# Altium schematic sheet 1-PF0100_PMIC.SchDoc
size B
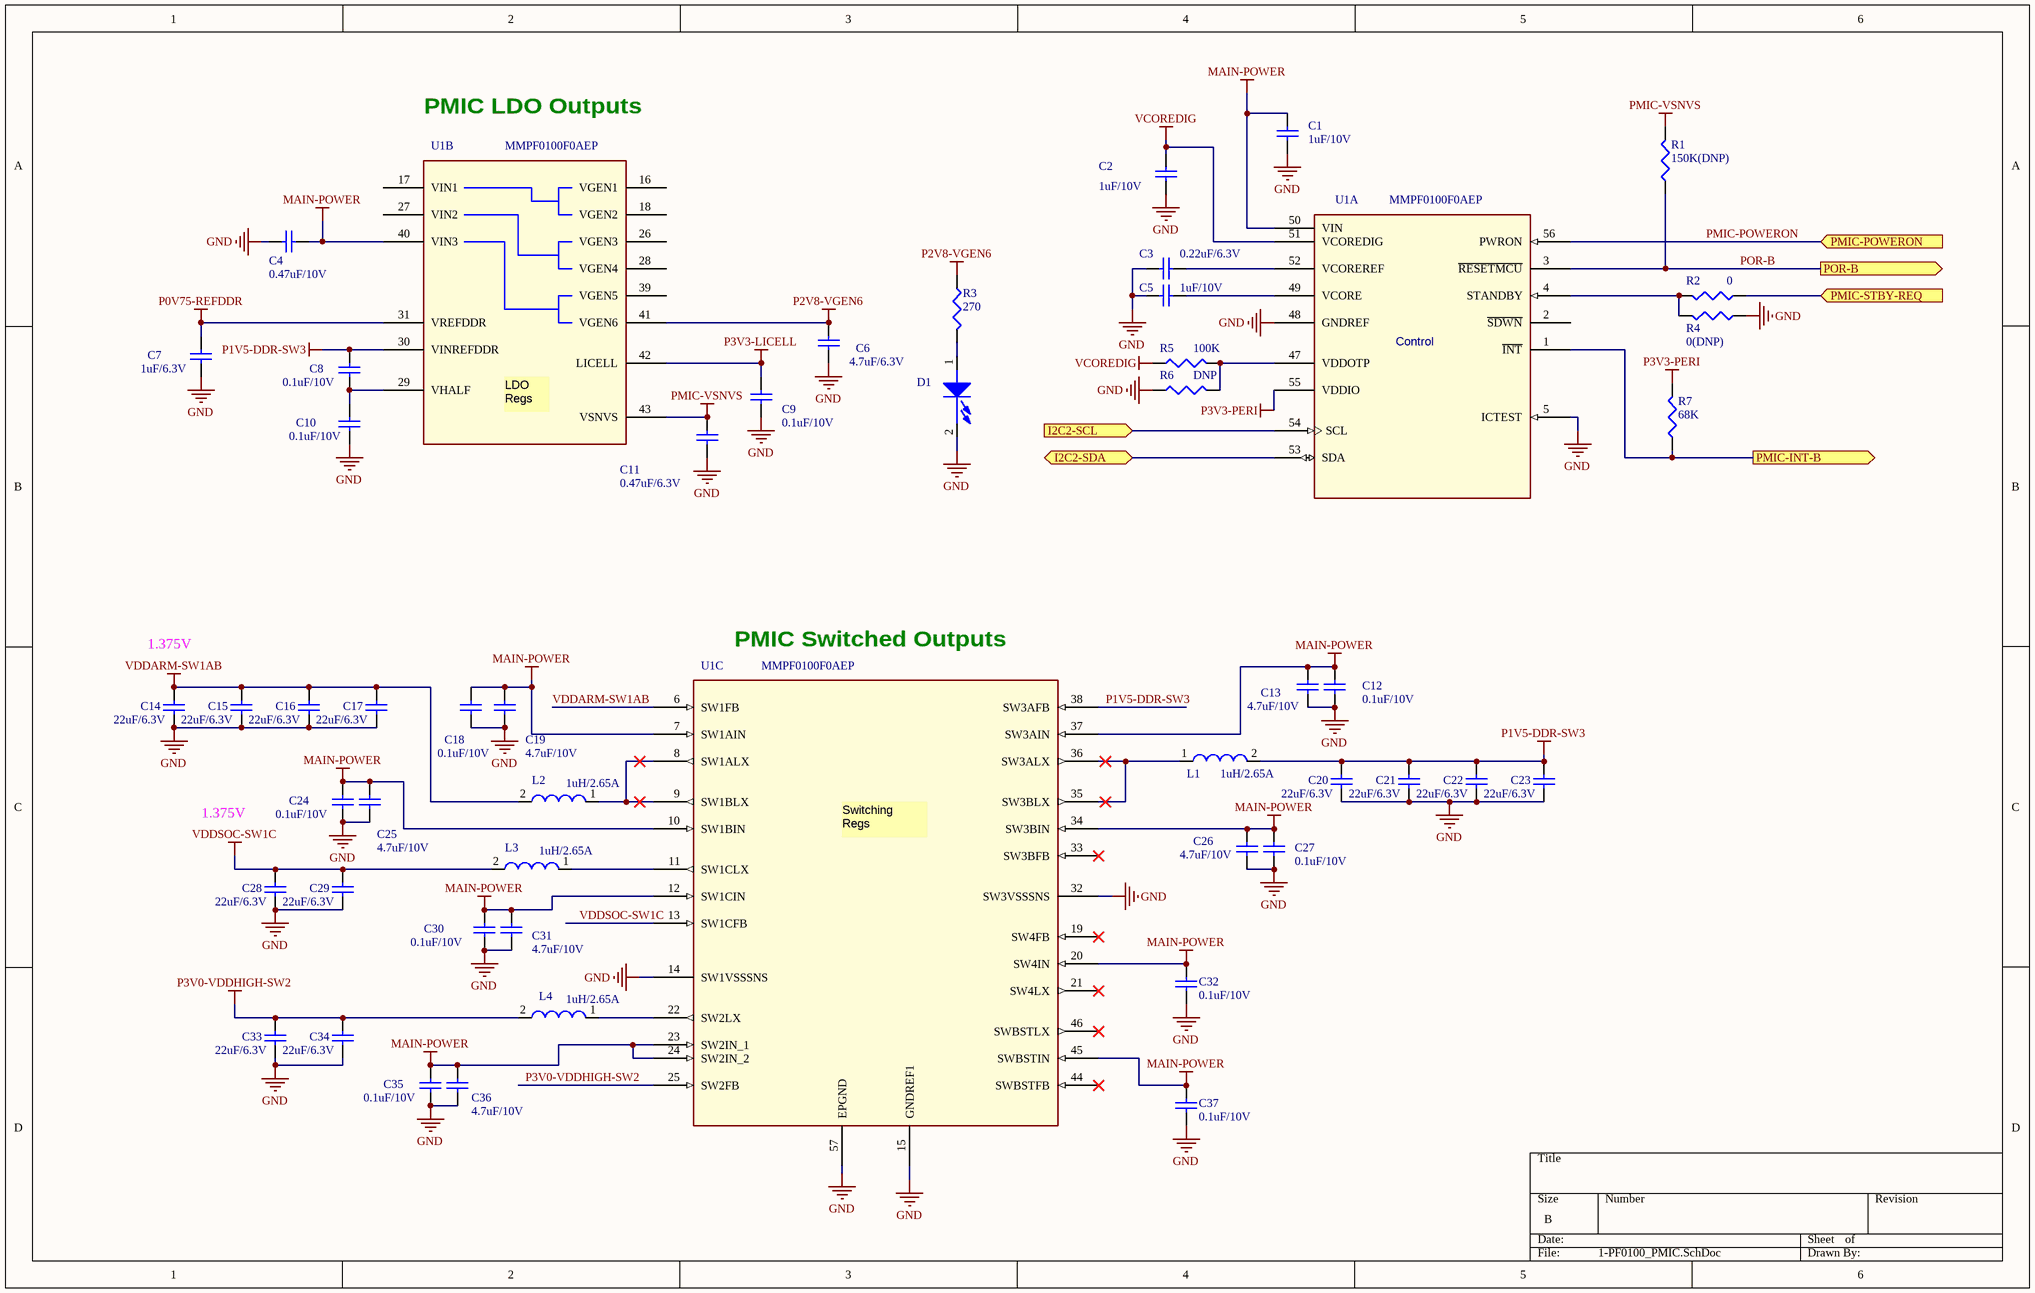
[diagram p0: 1-PF0100_PMIC.SchDoc]

## Parts
C1  1uF/10V  [0603_CC]
C2  1uF/10V  [0603_CC]
C3  0.22uF/6.3V  [0402_CC]
C4  0.47uF/10V  [0603_CC]
C5  1uF/10V  [0603_CC]
C6  4.7uF/6.3V  [0603_CC]
C7  1uF/6.3V  [0603_CC]
C8  0.1uF/10V  [0402_CC]
C9  0.1uF/10V  [0402_CC]
C10  0.1uF/10V  [0402_CC]
C11  0.47uF/6.3V  [0402_CC]
C12  0.1uF/10V  [0402_CC]
C13  4.7uF/10V  [0805_CC]
C14  22uF/6.3V  [0805_CC]
C15  22uF/6.3V  [0805_CC]
C16  22uF/6.3V  [0805_CC]
C17  22uF/6.3V  [0805_CC]
C18  0.1uF/10V  [0402_CC]
C19  4.7uF/10V  [0805_CC]
C20  22uF/6.3V  [0805_CC]
C21  22uF/6.3V  [0805_CC]
C22  22uF/6.3V  [0805_CC]
C23  22uF/6.3V  [0805_CC]
C24  0.1uF/10V  [0402_CC]
C25  4.7uF/10V  [0805_CC]
C26  4.7uF/10V  [0805_CC]
C27  0.1uF/10V  [0402_CC]
C28  22uF/6.3V  [0805_CC]
C29  22uF/6.3V  [0805_CC]
C30  0.1uF/10V  [0402_CC]
C31  4.7uF/10V  [0805_CC]
C32  0.1uF/10V  [0402_CC]
C33  22uF/6.3V  [0805_CC]
C34  22uF/6.3V  [0805_CC]
C35  0.1uF/10V  [0402_CC]
C36  4.7uF/10V  [0805_CC]
C37  0.1uF/10V  [0402_CC]
D1  LED GREEN  [LED0603]  (value not drawn)
L1  1uH/2.65A  [IND-1uH-2.65A]
L2  1uH/2.65A  [IND-1uH-2.65A]
L3  1uH/2.65A  [IND-1uH-2.65A]
L4  1uH/2.65A  [IND-1uH-2.65A]
R1  150K(DNP)  [0402_CC]
R2  0  [0402_CC]
R3  270  [0402_CC]
R4  0(DNP)  [0402_CC]
R5  100K  [0402_CC]
R6  DNP  [0402_CC]
R7  68K  [0402_CC]
U1  MMPF0100F0ZES  [QFN-56]  (value not drawn)  (parts A,B,C of 3)

## Ports
I2C2-SCL (in), I2C2-SDA (bidir), PMIC-INT-B (out), PMIC-POWERON (in), PMIC-STBY-REQ (in), POR-B (out)

## Nets
GND: C1.2 C2.2 C3.2 C4.2 C5.2 C6.2 C7.2 C9.2 C10.2 C11.2 C12.2 C13.2 C14.2 C15.2 C16.2 C17.2 C18.2 C19.2 C20.2 C21.2 C22.2 C23.2 C24.2 C25.2 C26.2 C27.2 C28.2 C29.2 C30.2 C31.2 C32.2 C33.2 C34.2 C35.2 C36.2 C37.1 D1.2(CATHODE) R4.1 R6.1 U1.5(ICTEST) U1.14(SW1VSSSNS) U1.15(GNDREF1) U1.32(SW3VSSSNS) U1.48(GNDREF) U1.57(EPGND)
MAIN-POWER: C1.1 C4.1 C12.1 C13.1 C18.1 C19.1 C24.1 C25.1 C26.1 C27.1 C30.1 C31.1 C32.1 C35.1 C36.1 C37.2 U1.7(SW1AIN) U1.10(SW1BIN) U1.12(SW1CIN) U1.20(SW4IN) U1.23(SW2IN_1) U1.24(SW2IN_2) U1.34(SW3BIN) U1.37(SW3AIN) U1.40(VIN3) U1.45(SWBSTIN) U1.50(VIN)
P0V75-REFDDR: C7.1 U1.31(VREFDDR)
P1V5-DDR-SW3: C8.1 C20.1 C21.1 C22.1 C23.1 L1.2 U1.30(VINREFDDR) U1.38(SW3AFB)
P2V8-VGEN6: C6.1 R3.1 U1.41(VGEN6)
P3V0-VDDHIGH-SW2: C33.1 C34.1 L4.2 U1.25(SW2FB)
P3V3-LICELL: C9.1 U1.42(LICELL)
P3V3-PERI: R7.2 U1.55(VDDIO)
PMIC-VSNVS: C11.1 R1.2 U1.43(VSNVS)
VCOREDIG: C2.1 R5.1 U1.51(VCOREDIG)
VDDARM-SW1AB: C14.1 C15.1 C16.1 C17.1 L2.2 U1.6(SW1FB)
VDDSOC-SW1C: C28.1 C29.1 L3.2 U1.13(SW1CFB)
I2C2-SCL: U1.54(SCL) ; port I2C2-SCL
I2C2-SDA: U1.53(SDA) ; port I2C2-SDA
PMIC-INT-B: R7.1 U1.1(~{INT}) ; port PMIC-INT-B
PMIC-POWERON: U1.56(PWRON) ; port PMIC-POWERON
PMIC-STBY-REQ: R2.1 ; port PMIC-STBY-REQ
POR-B: R1.1 U1.3(~{RESETMCU}) ; port POR-B
NetC3_1: C3.1 U1.52(VCOREREF)
NetC5_1: C5.1 U1.49(VCORE)
NetC8_2: C8.2 C10.1 U1.29(VHALF)
NetD1_1: D1.1(ANODE) R3.2
NetL1_1: L1.1 U1.35(SW3BLX) U1.36(SW3ALX)
NetL2_1: L2.1 U1.8(SW1ALX) U1.9(SW1BLX)
NetL3_1: L3.1 U1.11(SW1CLX)
NetL4_1: L4.1 U1.22(SW2LX)
NetR2_2: R2.2 R4.2 U1.4(STANDBY)
NetR5_2: R5.2 R6.2 U1.47(VDDOTP)

Not connected (* = marked no-connect by the designer): U1 2(~{SDWN}) 16(VGEN1) 17(VIN1) 18(VGEN2) 19(SW4FB)* 21(SW4LX)* 26(VGEN3) 27(VIN2) 28(VGEN4) 33(SW3BFB)* 39(VGEN5) 44(SWBSTFB)* 46(SWBSTLX)*

## Notes on the sheet
- PMIC LDO Outputs
- (near U1) MMPF0100F0AEP
- 1.375V
- PMIC Switched Outputs
- (in symbol MMPF0100NPZES_56P, part A) Control
- (in symbol MMPF0100NPZES_56P, part B) LDO / Regs
- (in symbol MMPF0100NPZES_56P, part C) Switching / Regs

## Library data of the parts
C1-C37 = Cap: Capacitor; Published: 8-Jun-2000; LatestRevisionDate: 17-Jul-2002; LatestRevisionNote: Re-released for DXP Platform.; PackageReference: RAD-0.3; Publisher: Altium Limited; PackageDescription: Radial Cap, Thru-Hole; 2 Leads; 0.3 in Pin Spacing
D1 = LN01401_1
L1 L2 = INDUCTOR: IND PWR 1UH@100KHZ 2.65A 20% SMT; CLASS: DISCRETE; CAD_APPROVED: Yes; MFG_PN01: LPS5015-102MLC; MFG_NAME01: Coilcraft; AGILE_PN: 180-77883; SIGNAL_MODEL: DEFAULT_INDUCTOR_1000nH_2_1; PART_TYPE: INDUCTOR; HEIGHT: 1.5MM; ROHS: Yes; Tolerance: 20%
L3 = INDUCTOR: IND PWR 1UH@1MHZ 2A 30% SMT; PART_TYPE: INDUCTOR\POWER; CLASS: DISCRETE; AGILE_PN: 180-77708; MFG_NAME01: TDK; MFG_PN01: VLS252010T-1R0N; CAD_APPROVED: Yes; SIGNAL_MODEL: DEFAULT_INDUCTOR_1000nH_2_1; Tolerance: 30%; ROHS: Yes; HEIGHT: 1.0 MM
L4 = INDUCTOR: IND PWR 1UH@1MHZ 2A 30% SMT; PART_TYPE: INDUCTOR\POWER; CLASS: DISCRETE; CAD_APPROVED: Yes; MFG_PN01: VLS252010T-1R0N; MFG_NAME01: TDK; AGILE_PN: 180-77708; SIGNAL_MODEL: DEFAULT_INDUCTOR_1000nH_2_1; HEIGHT: 1.0 MM; ROHS: Yes; Tolerance: 30%
R1-R7 = Res3: Resistor; Published: 8-Jun-2000; LatestRevisionDate: 29-May-2009; LatestRevisionNote: IPC-7351 Footprint Added.; PackageReference: J1-0603; Publisher: Altium Limited; PackageDescription: Chip Resistor
U1 = MMPF0100NPZES_56P: IC POWER MANAGEMENT 2.8-4.5V QFN56; CAD_APPROVED: Yes; MFG_PN01: MMPF0100F0EP; MFG_NAME01: FREESCALE SEMICONDUCTOR; AGILE_PN: 315-79631; CLASS: IC; HEIGHT: 0.9MM; ROHS: Yes